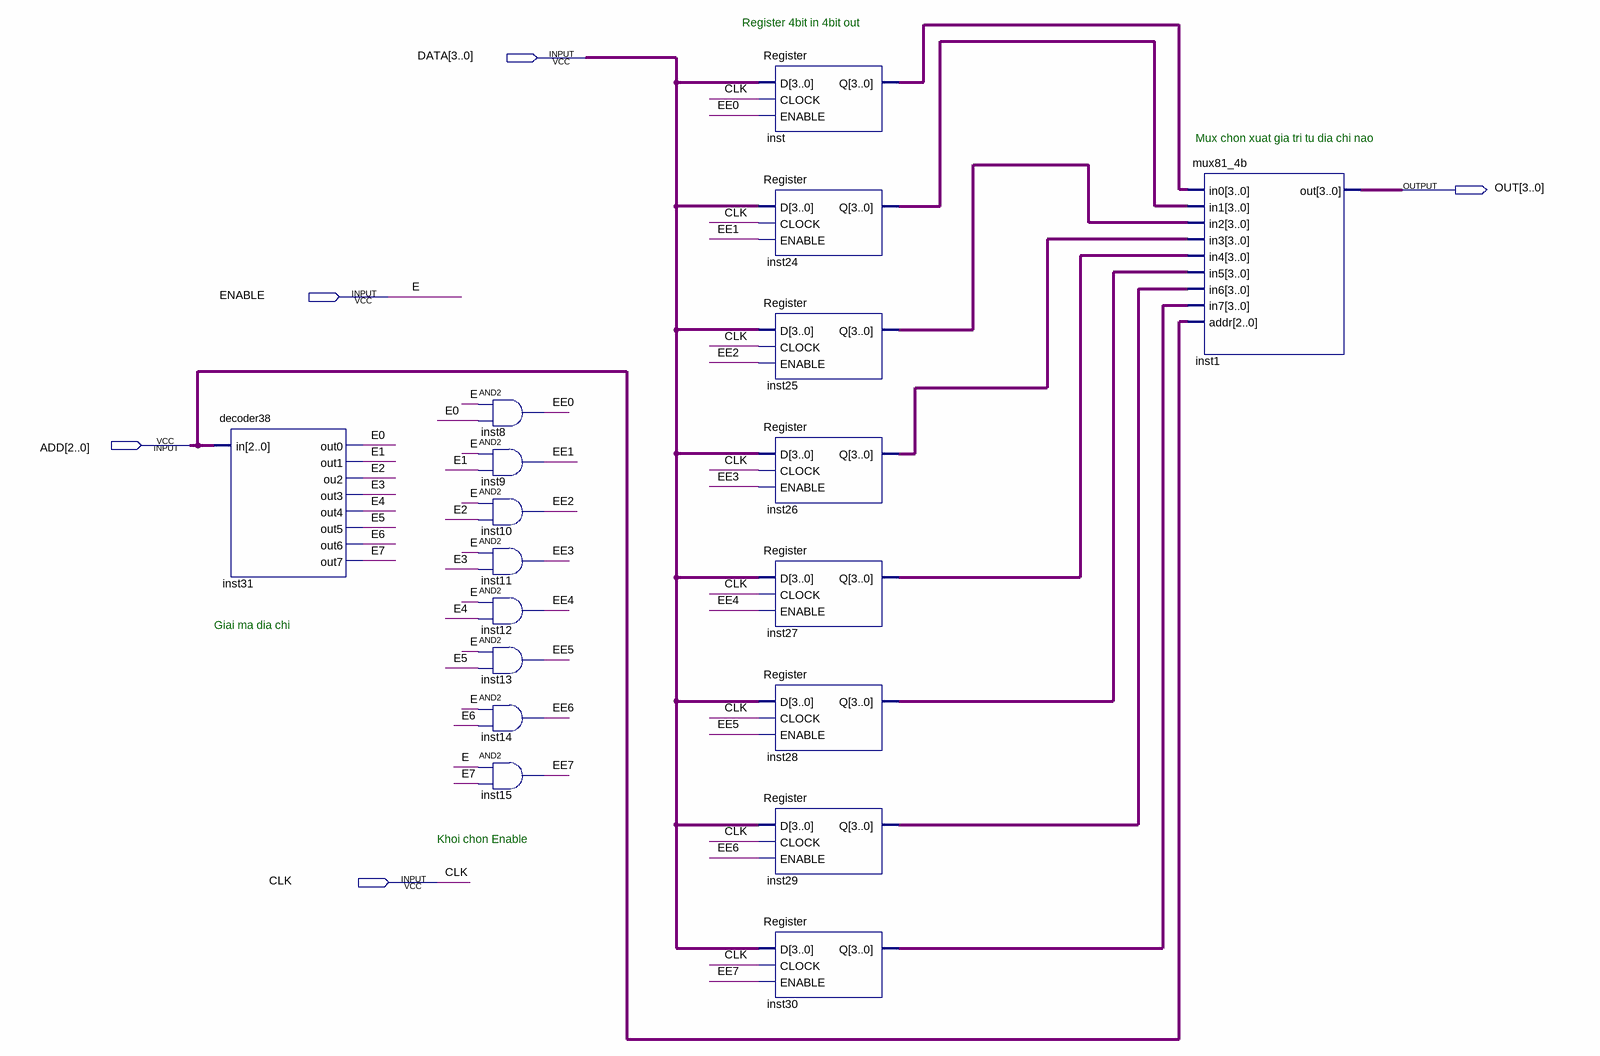
[diagram p0: schematic sheet]
// Quartus schematic Block3.bdf as structural Verilog: 18 symbols, 5 pins
module Block3 (
  input  [3:0] DATA,
  input  ENABLE,
  input  [2:0] ADD,
  input  CLK,
  output [3:0] OUT
);

  wire E0, E1, E2, E3, E4, E5, E6, E7, EE0, EE1, EE2, EE3, EE4, EE5, EE6, EE7;
  wire [3:0] inst24_q, inst25_q, inst26_q, inst27_q, inst28_q, inst29_q, inst30_q, inst_q;

  decoder38 inst31 (.in(ADD), .out0(E0), .out1(E1), .ou2(E2), .out3(E3), .out4(E4), .out5(E5), .out6(E6), .out7(E7));
  and inst8 (EE0, ENABLE, E0);
  and inst9 (EE1, ENABLE, E1);
  and inst10 (EE2, ENABLE, E2);
  and inst11 (EE3, ENABLE, E3);
  and inst12 (EE4, ENABLE, E4);
  and inst13 (EE5, ENABLE, E5);
  and inst14 (EE6, ENABLE, E6);
  and inst15 (EE7, ENABLE, E7);
  Register inst (.D(DATA), .CLOCK(CLK), .ENABLE(EE0), .Q(inst_q));
  Register inst24 (.D(DATA), .CLOCK(CLK), .ENABLE(EE1), .Q(inst24_q));
  Register inst25 (.D(DATA), .CLOCK(CLK), .ENABLE(EE2), .Q(inst25_q));
  Register inst26 (.D(DATA), .CLOCK(CLK), .ENABLE(EE3), .Q(inst26_q));
  Register inst27 (.D(DATA), .CLOCK(CLK), .ENABLE(EE4), .Q(inst27_q));
  Register inst28 (.D(DATA), .CLOCK(CLK), .ENABLE(EE5), .Q(inst28_q));
  Register inst29 (.D(DATA), .CLOCK(CLK), .ENABLE(EE6), .Q(inst29_q));
  Register inst30 (.D(DATA), .CLOCK(CLK), .ENABLE(EE7), .Q(inst30_q));
  mux81_4b inst1 (
    .in0(inst_q), .in1(inst24_q), .in2(inst25_q), .in3(inst26_q), .in4(inst27_q), .in5(inst28_q),
    .in6(inst29_q), .in7(inst30_q), .addr(ADD), .out(OUT));

  // Other names for the same wires on the sheet: E = ENABLE

  // Notes on the sheet:
  //   Register 4bit in 4bit out
  //   Mux chon xuat gia tri tu dia chi nao
  //   Giai ma dia chi
  //   Khoi chon Enable
endmodule
